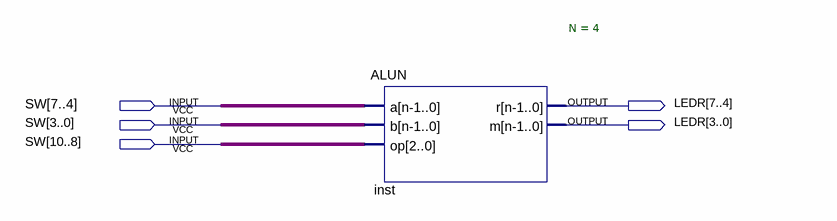
[diagram p0: schematic sheet]
// Quartus schematic ALUN_Demo.bdf as structural Verilog: 1 symbols, 5 pins
module ALUN_Demo (
  input  [10:0] SW,
  output [7:0] LEDR
);

  ALUN #(.N(4)) inst (.a(SW[7:4]), .b(SW[3:0]), .op(SW[10:8]), .r(LEDR[7:4]), .m(LEDR[3:0]));
endmodule
